# Altium schematic sheet Connections.SchDoc
size A4
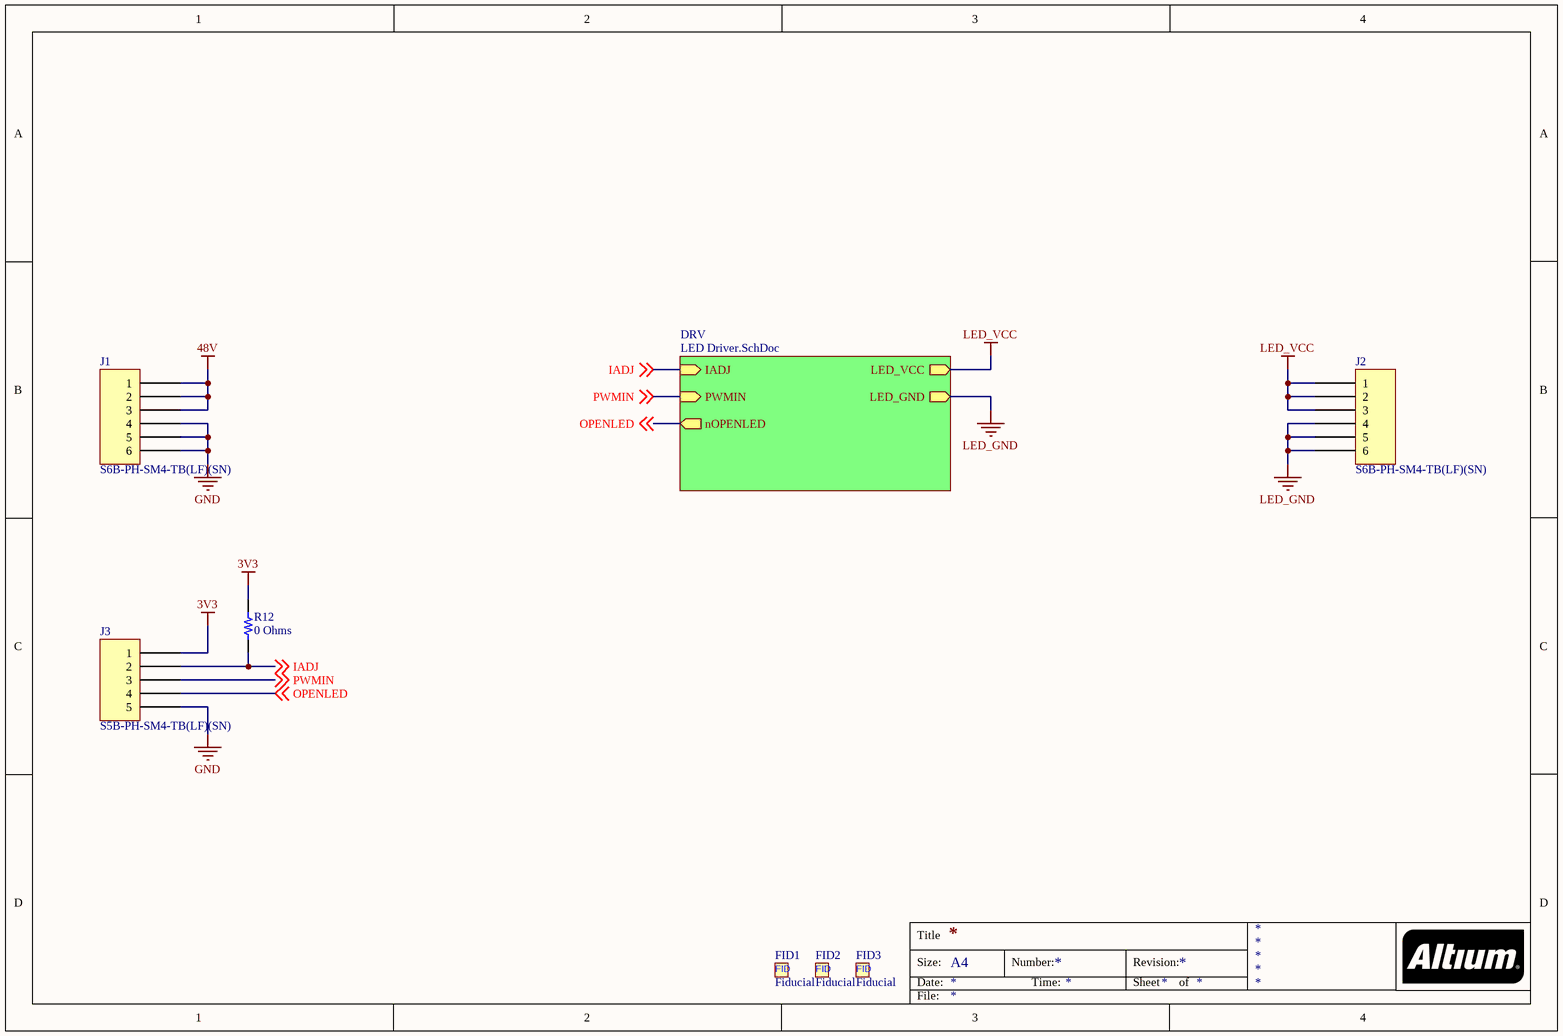
[diagram p0: Connections.SchDoc]

## Parts
FID1  Fiducial  [Fiducial]  (no BOM)
FID2  Fiducial  [Fiducial]  (no BOM)
FID3  Fiducial  [Fiducial]  (no BOM)
J1  S6B-PH-SM4-TB(LF)(SN)  [JST S6B-PH-SM4-TB]
J2  S6B-PH-SM4-TB(LF)(SN)  [JST S6B-PH-SM4-TB]
J3  S5B-PH-SM4-TB(LF)(SN)  [JST S5B-PH-SM4-TB]
R12  0 Ohms  [RES 0603_1608]

## Sub-sheets
DRV = LED Driver.SchDoc: IADJ (in), nOPENLED (out), PWMIN (in), LED_VCC (out), LED_GND (out)

## Nets
3V3: J3.1 R12.2
48V: J1.1 J1.2 J1.3
GND: J1.4 J1.5 J1.6 J3.5
LED_GND: J2.4 J2.5 J2.6 ; sheet DRV/LED_GND
LED_VCC: J2.1 J2.2 J2.3 ; sheet DRV/LED_VCC
IADJ: J3.2 R12.1 ; off-sheet IADJ, sheet DRV/IADJ
OPENLED: J3.4 ; off-sheet OPENLED, sheet DRV/nOPENLED
PWMIN: J3.3 ; off-sheet PWMIN, sheet DRV/PWMIN

## Notes on the sheet
- Title
- Size:
- Date:
- A4
- Number:
- Time:
- Revision:
- Sheet
- of
- File:
- (in symbol Fiducial) FID

## Library data of the parts
J1 J2 = S6B-PH-SM4-TB(LF)(SN): CONN HEADER SMD R/A 6POS 2MM; Manufacturer: JST Sales America Inc.; Contact Length - Mating: 0.130" (3.30mm); Current Rating (Amps): 2A; Material Flammability Rating: UL94 V-0; Number of Positions: 6; Number of Positions Loaded: All; Pitch - Mating: 0.079" (2.00mm); Shrouding: Shrouded - 4 Wall; Style: Board to Cable/Wire; Voltage Rating: 100V; Part Number: S6B-PH-SM4-TB(LF)(SN); ComponentLink1Description: Datasheet; ComponentLink1URL: http://www.jst-mfg.com/product/pdf/eng/ePH.pdf; ComponentLink2Description: DigiKey Link; ComponentLink2URL: http://digikey.com/product-detail/en/jst-sales-america-inc/S6B-PH-SM4-TB-LF-SN/455-1753-1-ND/926850; Connector Type: Header; Contact Finish - Mating: Tin; Contact Finish - Post: Tin; Contact Material: Copper Alloy; Contact Shape: Square; Contact Type: Male Pin; Fastening Type: Detent Lock; Features: Solder Retention; Insulation Color: Natural; Insulation Height: 0.217" (5.51mm); Insulation Material: Polyamide (PA6T), Nylon 6T; LastUpdated: 15/01/2020 03:38:11; Lifecycle Status: Active; Minimum Order: 1; Mounting Type: Surface Mount, Right Angle; Number of Rows: 1; Operating Temperature: -25°C ~ 85°C; Packaging: TapeAndReel; PartId: 112; Part Status: Active; Price: 0.45; Series: PH; Supplier 1: DigiKey; Supplier Part Number 1: 455-1753-1-ND; Termination: Solder
J3 = S5B-PH-SM4-TB(LF)(SN): CONN HEADER SMD R/A 5POS 2MM; Manufacturer: JST Sales America Inc.; Contact Length - Mating: 0.130" (3.30mm); Current Rating (Amps): 2A; Material Flammability Rating: UL94 V-0; Number of Positions: 5; Number of Positions Loaded: All; Pitch - Mating: 0.079" (2.00mm); Shrouding: Shrouded - 4 Wall; Style: Board to Cable/Wire; Voltage Rating: 100V; Part Number: S5B-PH-SM4-TB(LF)(SN); ComponentLink1Description: Datasheet; ComponentLink1URL: http://www.jst-mfg.com/product/pdf/eng/ePH.pdf; ComponentLink2Description: DigiKey Link; ComponentLink2URL: http://digikey.com/product-detail/en/jst-sales-america-inc/S5B-PH-SM4-TB-LF-SN/455-1752-1-ND/926849; Connector Type: Header; Contact Finish - Mating: Tin; Contact Finish - Post: Tin; Contact Material: Copper Alloy; Contact Shape: Square; Contact Type: Male Pin; Fastening Type: Detent Lock; Features: Solder Retention; Insulation Color: Natural; Insulation Height: 0.217" (5.51mm); Insulation Material: Polyamide (PA6T), Nylon 6T; LastUpdated: 15/01/2020 03:45:44; Lifecycle Status: Active; Minimum Order: 1; Mounting Type: Surface Mount, Right Angle; Number of Rows: 1; Operating Temperature: -25°C ~ 85°C; Packaging: TapeAndReel; PartId: 118; Part Status: Active; Price: 0.39; Series: PH; Supplier 1: DigiKey; Supplier Part Number 1: 455-1752-1-ND; Termination: Solder
R12 = ERJ-3GEY0R00V: RES SMD 0 OHM JUMPER 1/10W 0603; Manufacturer: Panasonic Electronic Components; Power (Watts): 0.1W, 1/10W; Part Number: ERJ-3GEY0R00V; Value: 0 Ohms; ComponentLink1Description: Datasheet; ComponentLink1URL: http://industrial.panasonic.com/www-cgi/jvcr13pz.cgi?E+PZ+3+AOA0001+ERJ3GEY0R00V+7+WW; ComponentLink2Description: DigiKey Link; ComponentLink2URL: http://digikey.com/product-detail/en/panasonic-electronic-components/ERJ-3GEY0R00V/P0.0GCT-ND/134711; Composition: Thick Film; Device Package: 0603 (1608 Metric); Features: Automotive AEC-Q200; Height - Seated (Max): 0.022" (0.55mm); LastUpdated: 15/01/2020 00:08:11; Lifecycle Status: Active; Minimum Order: 1; Number of Terminations: 2; Operating Temperature: -55°C ~ 155°C; Package / Case: 0603 (1608 Metric); Packaging: TapeAndReel; PartId: 22603; Part Status: Active; Price: 0.01; Ratings: AEC-Q200; Resistance: 0 Ohms; Series: ERJ; Size / Dimension: 0.063" L x 0.031" W (1.60mm x 0.80mm); Supplier 1: DigiKey; Supplier Part Number 1: P0.0GCT-ND; Supplier Device Package: 0603; Tolerance: Jumper